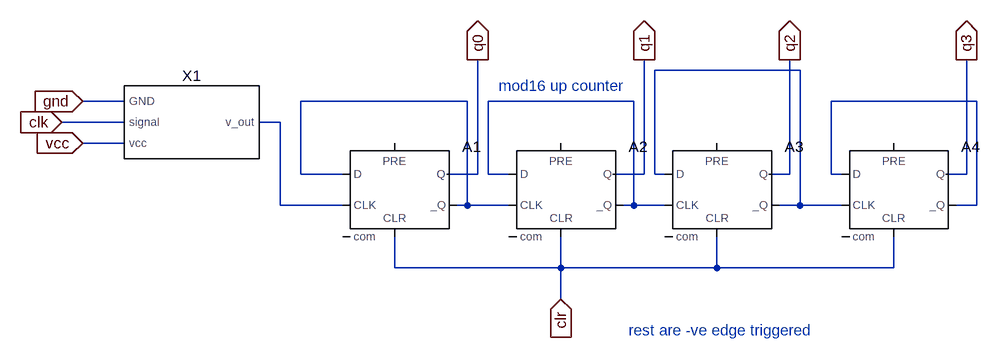
[diagram p0: schematic mod16UpCounter_ckt.asc]
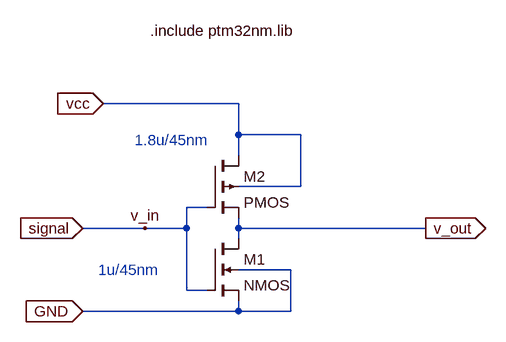
[diagram p1: sub-circuit fast_inverterckt.asc]
mod16UpCounter_ckt.asc, the LTspice schematic file:
Version 4
SHEET 1 1048 680
WIRE 720 -48 496 -48
WIRE -320 0 -384 0
WIRE 208 0 -48 0
WIRE 464 0 240 0
WIRE 992 0 768 0
WIRE -320 32 -416 32
WIRE -80 32 -112 32
WIRE -320 64 -384 64
WIRE -48 112 -48 0
WIRE 16 112 -48 112
WIRE 224 112 224 -64
WIRE 224 112 176 112
WIRE 240 112 240 0
WIRE 272 112 240 112
WIRE 480 112 480 -64
WIRE 480 112 432 112
WIRE 496 112 496 -48
WIRE 512 112 496 112
WIRE 704 112 704 -64
WIRE 704 112 672 112
WIRE 768 112 768 0
WIRE 784 112 768 112
WIRE 976 112 976 -64
WIRE 976 112 944 112
WIRE -80 160 -80 32
WIRE 16 160 -80 160
WIRE 208 160 208 0
WIRE 208 160 192 160
WIRE 272 160 208 160
WIRE 464 160 464 0
WIRE 464 160 448 160
WIRE 512 160 464 160
WIRE 720 160 720 -48
WIRE 720 160 688 160
WIRE 784 160 720 160
WIRE 992 160 992 0
WIRE 992 160 960 160
WIRE 96 256 96 208
WIRE 352 256 352 208
WIRE 352 256 96 256
WIRE 592 256 592 208
WIRE 592 256 352 256
WIRE 864 256 864 208
WIRE 864 256 592 256
WIRE 352 304 352 256
FLAG 224 -64 q0
IOPIN 224 -64 Out
FLAG 480 -64 q1
IOPIN 480 -64 Out
FLAG 704 -64 q2
IOPIN 704 -64 Out
FLAG 352 304 clr
IOPIN 352 304 In
FLAG -416 32 clk
IOPIN -416 32 In
FLAG 976 -64 q3
IOPIN 976 -64 Out
FLAG -384 64 vcc
IOPIN -384 64 In
FLAG -384 0 gnd
IOPIN -384 0 In
SYMBOL Digital\\dflop 96 64 R0
SYMATTR InstName A1
SYMBOL Digital\\dflop 352 64 R0
SYMATTR InstName A2
SYMBOL Digital\\dflop 592 64 R0
SYMATTR InstName A3
SYMBOL Digital\\dflop 864 64 R0
SYMATTR InstName A4
SYMBOL fast_inverterCKT -224 32 R0
SYMATTR InstName X1
TEXT 456 352 Left 2 ;rest are -ve edge triggered
TEXT 256 -24 Left 2 ;mod16 up counter

fast_inverterckt.asc, the sub-circuit schematic file:
Version 4
SHEET 1 1464 680
WIRE 352 32 144 32
WIRE 352 80 352 32
WIRE 448 80 352 80
WIRE 352 112 352 80
WIRE 448 160 448 80
WIRE 448 160 352 160
WIRE 304 192 272 192
WIRE 208 224 112 224
WIRE 272 224 272 192
WIRE 272 224 208 224
WIRE 352 224 352 208
WIRE 640 224 352 224
WIRE 352 240 352 224
WIRE 432 288 352 288
WIRE 272 320 272 224
WIRE 304 320 272 320
WIRE 352 352 352 336
WIRE 352 352 112 352
WIRE 432 352 432 288
WIRE 432 352 352 352
FLAG 208 224 v_in
FLAG 144 32 vcc
IOPIN 144 32 In
FLAG 112 224 signal
IOPIN 112 224 In
FLAG 112 352 GND
IOPIN 112 352 In
FLAG 640 224 v_out
IOPIN 640 224 Out
SYMBOL nmos4 304 240 R0
SYMATTR InstName M1
SYMATTR Value2 l=45nm w=1u
SYMBOL pmos4 304 112 R0
SYMATTR InstName M2
SYMATTR Value2 l=45nm w=1.8u
TEXT 192 88 Left 2 ;1.8u/45nm
TEXT 136 288 Left 2 ;1u/45nm
TEXT 216 -80 Left 2 !.include ptm32nm.lib

The netlist it stands for:
* mod16UpCounter_ckt.asc
A1 N002 0 N005 0 clr N002 q0 0 DFLOP
A2 N003 0 N002 0 clr N003 q1 0 DFLOP
A3 N001 0 N003 0 clr N001 q2 0 DFLOP
A4 N004 0 N001 0 clr N004 q3 0 DFLOP
XX1 gnd clk vcc N005 fast_inverterckt

* block symbol definitions
.subckt fast_inverterckt GND signal vcc v_out
M1 v_out signal GND GND NMOS l=45nm w=1u
M2 vcc signal v_out vcc PMOS l=45nm w=1.8u
* 1.8u/45nm
* 1u/45nm
.include ptm32nm.lib
.ends fast_inverterckt

.model NMOS NMOS
.model PMOS PMOS
.lib standard.mos
* rest are -ve edge triggered
* mod16 up counter
.backanno
.end